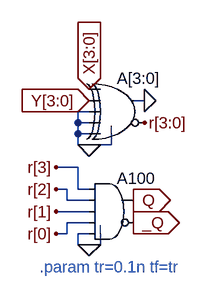
[diagram p0: schematic eq-4bit.asc]
eq-4bit.asc, the LTspice schematic file:
Version 4
SHEET 1 880 680
WIRE 176 112 160 112
WIRE 96 128 80 128
WIRE 80 144 80 128
WIRE 96 144 80 144
WIRE 80 160 80 144
WIRE 96 160 80 160
WIRE 80 176 80 160
WIRE 96 176 80 176
WIRE 128 176 128 160
WIRE 128 176 96 176
WIRE 80 208 48 208
WIRE 64 240 48 240
WIRE 80 240 80 208
WIRE 96 240 80 240
WIRE 64 256 64 240
WIRE 96 256 64 256
WIRE 96 272 48 272
WIRE 96 288 64 288
WIRE 64 304 64 288
WIRE 64 304 48 304
WIRE 96 304 80 304
WIRE 80 320 80 304
WIRE 96 320 80 320
WIRE 112 320 112 304
WIRE 112 320 96 320
FLAG 96 176 0
FLAG 96 96 X[3:0]
IOPIN 96 96 In
FLAG 96 112 Y[3:0]
IOPIN 96 112 In
FLAG 176 112 0
FLAG 176 144 r[3:0]
FLAG 96 320 0
FLAG 48 208 r[3]
FLAG 48 240 r[2]
FLAG 160 256 Q
IOPIN 160 256 Out
FLAG 160 288 _Q
IOPIN 160 288 Out
FLAG 48 272 r[1]
FLAG 48 304 r[0]
SYMBOL Digital\\xor 144 64 R0
SYMATTR InstName A[3:0]
SYMBOL Digital\\and 128 208 R0
SYMATTR InstName A100
TEXT 24 352 Left 2 ;.param tr=0.1n tf=tr

The netlist it stands for:
* eq-4bit.asc
A[3:0] X[3:0] Y[3:0] 0 0 0 r[3:0] 0 0 XOR
A100 r[3] r[2] r[1] r[0] 0 _Q Q 0 AND
* .param tr=0.1n tf=tr
.backanno
.end